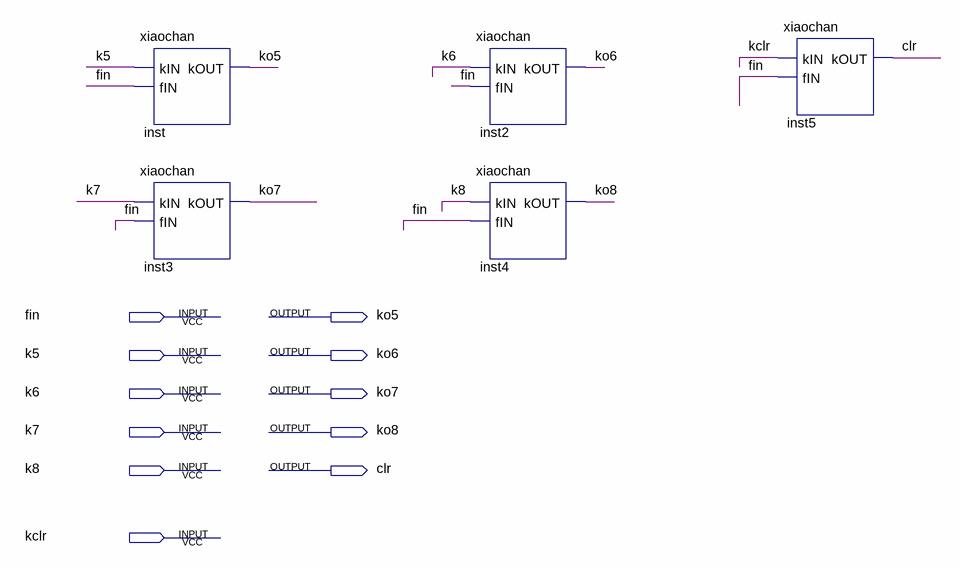
[diagram p0: schematic sheet]
// Quartus schematic rilixiaochan.bdf as structural Verilog: 5 symbols, 11 pins
module rilixiaochan (
  input  fin,
  input  k5,
  input  k6,
  input  k7,
  input  k8,
  input  kclr,
  output ko5,
  output ko6,
  output ko7,
  output ko8,
  output clr
);

  xiaochan inst (.kIN(k5), .fIN(fin), .kOUT(ko5));
  xiaochan inst3 (.kIN(k7), .fIN(fin), .kOUT(ko7));
  xiaochan inst2 (.kIN(k6), .fIN(fin), .kOUT(ko6));
  xiaochan inst4 (.kIN(k8), .fIN(fin), .kOUT(ko8));
  xiaochan inst5 (.kIN(kclr), .fIN(fin), .kOUT(clr));
endmodule
